# EAGLE design first_node_v2 (EAGLE 9.2.2)
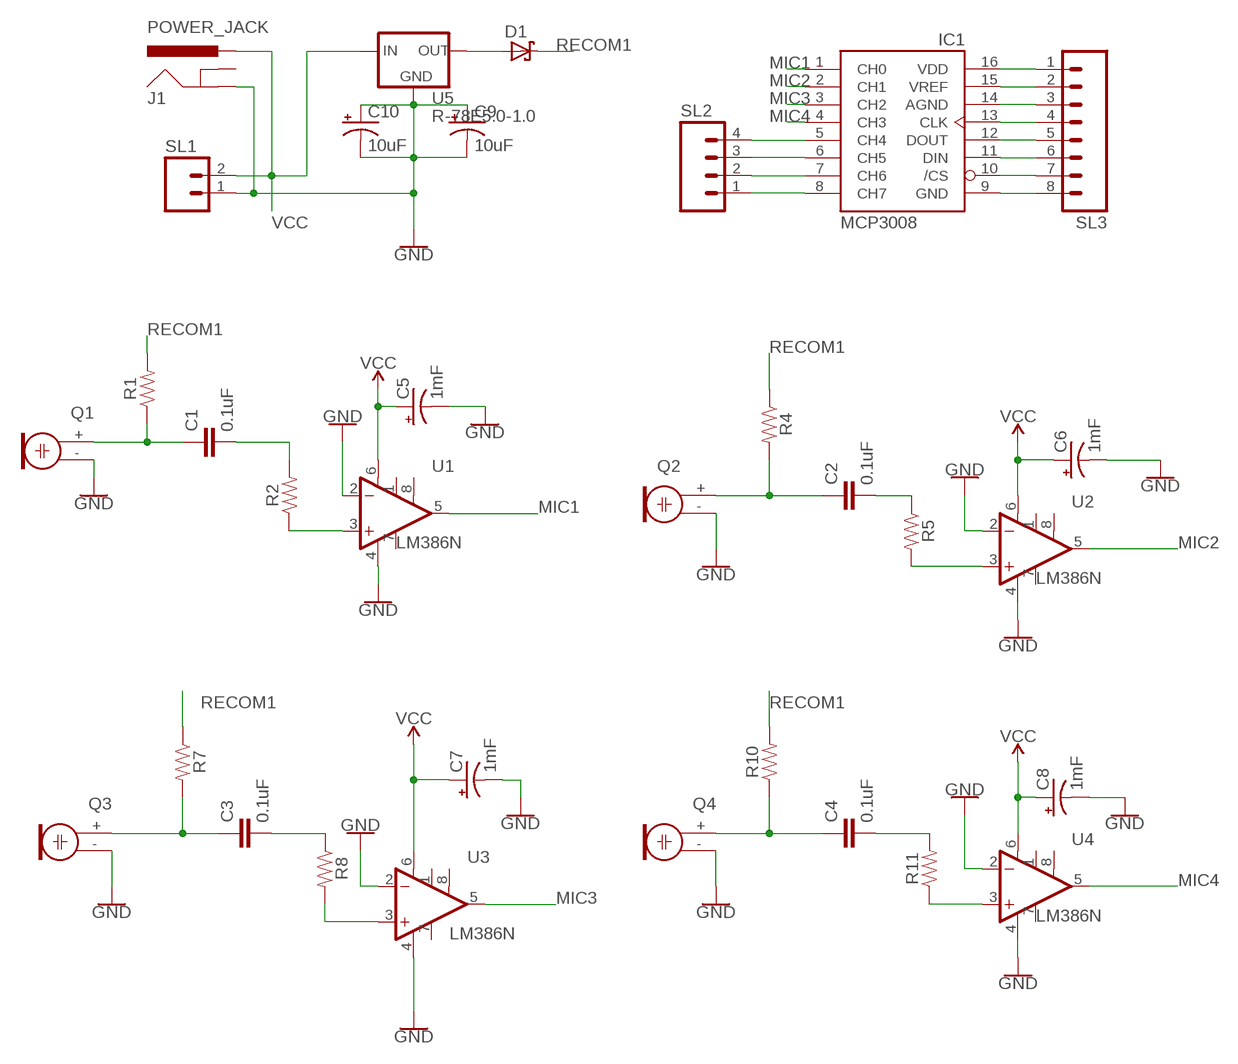
[diagram p0: schematic, sheet 1]

## Parts
C1  0.1uF  0.1UF-KIT-EZ-50V-20%  [CAP-PTH-SMALL-KIT]
C2  0.1uF  0.1UF-KIT-EZ-50V-20%  [CAP-PTH-SMALL-KIT]
C3  0.1uF  0.1UF-KIT-EZ-50V-20%  [CAP-PTH-SMALL-KIT]
C4  0.1uF  0.1UF-KIT-EZ-50V-20%  [CAP-PTH-SMALL-KIT]
C5  1mF  1000UF-RADIAL-5MM-25V-20%  [CPOL-RADIAL-5MM-10MM]
C6  1mF  1000UF-RADIAL-5MM-25V-20%  [CPOL-RADIAL-5MM-10MM]
C7  1mF  1000UF-RADIAL-5MM-25V-20%  [CPOL-RADIAL-5MM-10MM]
C8  1mF  1000UF-RADIAL-5MM-25V-20%  [CPOL-RADIAL-5MM-10MM]
C9  10uF  10UF-POLAR-RADIAL-2.5MM-25V-20%  [CPOL-RADIAL-2.5MM-5MM]
C10  10uF  10UF-POLAR-RADIAL-2.5MM-25V-20%  [CPOL-RADIAL-2.5MM-5MM]
D1  SCHOTTKY-DIODECB429-17  [CB429-17]
IC1  MCP3008  [DIL16]
J1  POWER_JACK  [POWER_JACK_PTH]
Q1  ELECTRET  [9.7ELECTRET]
Q2  ELECTRET  [9.7ELECTRET]
Q3  ELECTRET  [9.7ELECTRET]
Q4  ELECTRET  [9.7ELECTRET]
R1  RESISTORAXIAL-0.3  [AXIAL-0.3]
R2  RESISTORAXIAL-0.3  [AXIAL-0.3]
R4  RESISTORAXIAL-0.3  [AXIAL-0.3]
R5  RESISTORAXIAL-0.3  [AXIAL-0.3]
R7  RESISTORAXIAL-0.3  [AXIAL-0.3]
R8  RESISTORAXIAL-0.3  [AXIAL-0.3]
R10  RESISTORAXIAL-0.3  [AXIAL-0.3]
R11  RESISTORAXIAL-0.3  [AXIAL-0.3]
SL1  M02  [02P]
SL2  M04  [04P]
SL3  M08  [08P]
U1  LM386N  LM386  [DIP08]
U2  LM386N  LM386  [DIP08]
U3  LM386N  LM386  [DIP08]
U4  LM386N  LM386  [DIP08]
U5  R-78E5.0-1.0  [DC-DC_CONVERTER_78XX]

## Nets
GND: C5.- C6.- C7.- C8.- C9.1(+) C9.2(-) C10.1(+) C10.2(-) J1.GND Q1.- Q2.- Q3.- Q4.- SL1.1 U1.2(-IN) U1.4(V-) U2.2(-IN) U2.4(V-) U3.2(-IN) U3.4(V-) U4.2(-IN) U4.4(V-) U5.GND
MIC1: IC1.1(CH0) U1.5(OUT)
MIC2: IC1.2(CH1) U2.5(OUT)
MIC3: IC1.3(CH2) U3.5(OUT)
MIC4: IC1.4(CH3) U4.5(OUT)
N$1: C1.1 Q1.+ R1.P$1
N$2: C1.2 R2.P$2
N$3: C2.1 Q2.+ R4.P$2
N$4: C2.2 R5.P$1
N$5: C3.1 Q3.+ R7.P$2
N$6: C4.1 Q4.+ R10.P$1
N$7: C3.2 R8.P$1
N$9: C4.2 R11.P$2
N$10: IC1.5(CH4) SL2.4
N$11: R8.P$2 U3.3(+IN)
N$12: IC1.6(CH5) SL2.3
N$13: D1.A U5.VOUT(OUT)
N$14: IC1.7(CH6) SL2.2
N$15: IC1.8(CH7) SL2.1
N$16: IC1.16(VDD) SL3.1
N$17: IC1.15(VREF) SL3.2
N$18: IC1.14(AGND) SL3.3
N$19: IC1.13(CLK) SL3.4
N$20: IC1.12(DOUT) SL3.5
N$21: IC1.11(DIN) SL3.6
N$22: IC1.10(/CS) SL3.7
N$23: IC1.9(GND) SL3.8
N$24: R2.P$1 U1.3(+IN)
N$25: R11.P$1 U4.3(+IN)
N$27: R5.P$2 U2.3(+IN)
RECOM1: D1.C R1.P$2 R4.P$1 R7.P$1 R10.P$2
VCC: C5.+ C6.+ C7.+ C8.+ J1.PWR SL1.2 U1.6(V+) U2.6(V+) U3.6(V+) U4.6(V+) U5.VIN(IN)
Unconnected: J1.GNDBREAK U1.1(GAIN) U1.7(BP) U1.8(GAIN) U2.1(GAIN) U2.7(BP) U2.8(GAIN) U3.1(GAIN) U3.7(BP) U3.8(GAIN) U4.1(GAIN) U4.7(BP) U4.8(GAIN)

## Library data of the parts
C1-C4 = SparkFun-Capacitors:0.1UF: 0.1µF ceramic capacitors A capacitor is a passive two-terminal electrical component used to store electrical energy temporarily in an electric field.; PROD_ID: CAP-08370
C5-C8 = SparkFun-Capacitors:1000UF: 1,000µF/1mF ceramic capacitors A capacitor is a passive two-terminal electrical component used to store electrical energy temporarily in an electric field. CAP-08070; PROD_ID: CAP-09538
C9 C10 = SparkFun-Capacitors:10UF-POLAR: 10.0µF polarized capacitors A capacitor is a passive two-terminal electrical component used to store electrical energy temporarily in an electric field.; PROD_ID: CAP-08440
D1 = adafruit:SCHOTTKY-DIODE: Schottky Diode
IC1 = adafruit:MCP3008
J1 = SparkFun-Connectors:POWER_JACK: Power Jack Connector This is the standard 5.5mm barrel jack for power. The PTH is the most common, proven, reliable, footprint. The Slot footprint only works if the mill layer is transmitted to the PCB fab house so be warned. Here are the connectors we sell at SparkFun: DC Barrel Power Jack/Connector <https://www.sparkfun.com/products/119> (PRT-00119) DC Barrel Power Jack/Connector (SMD) <https://www.sparkfun.com/products/12748> (PRT-12748) DC Barrel Jack Adapter - Breadboard Compatible <https://www.sparkfun.com/products/10811> (PRT-10811) It is used on this SparkFun product (and many, many others): SparkFun RedBoard - Programmed with Arduino <https://www.sparkfun.com/products/12757> (DEV-12757) Also, if you need a mating power supply or connector, please check these out: Wall Adapter Power Supply - 9VDC 650mA <https://www.sparkfun.com/products/298> (TOL-00298) DC Barrel Jack Adapter - Male <https://www.sparkfun.com/products/10287> (PRT-10287); PROD_ID: CONN-08197
Q1-Q4 = adafruit:ELECTRET: Electret microphone Thru hole 2.54mm spacing with 9.7mm diameter
R1 R2 R4 R5 R7 R8 R10 R11 = SparkFun-Resistors:RESISTOR: Generic Resistor Package
SL1 = con-amp-quick:M02: AMP QUICK CONNECTOR; OC_FARNELL: unknown; OC_NEWARK: unknown
SL2 = con-amp-quick:M04: AMP QUICK CONNECTOR; OC_FARNELL: unknown; OC_NEWARK: unknown
SL3 = con-amp-quick:M08: AMP QUICK CONNECTOR; OC_FARNELL: unknown; OC_NEWARK: unknown
U1-U4 = SparkFun-IC-Amplifiers:LM386: low voltage audio power amplifier SparkFun Products FabFM Radio Kit <https://www.sparkfun.com/products/11043> (KIT-11043); PROD_ID: IC-10899
U5 = SparkFun-IC-Power:R-78E5.0-1.0: Recom Power 5V 1A DC/DC Converter The Recom R-78E5.0-X.X is a compact DC/DC converter module that is a pin for pin drop-in replacement for the LM7805 linear voltage regulator. Specifications: Input Range: 7-28V Output Voltage: 5V Output Current: 1A Max Efficiency: 91% Datasheet <https://www.recom-power.com/pdf/Innoline/R-78Exx-1.0.pdf>; PROD_ID: COM-13655

## Board
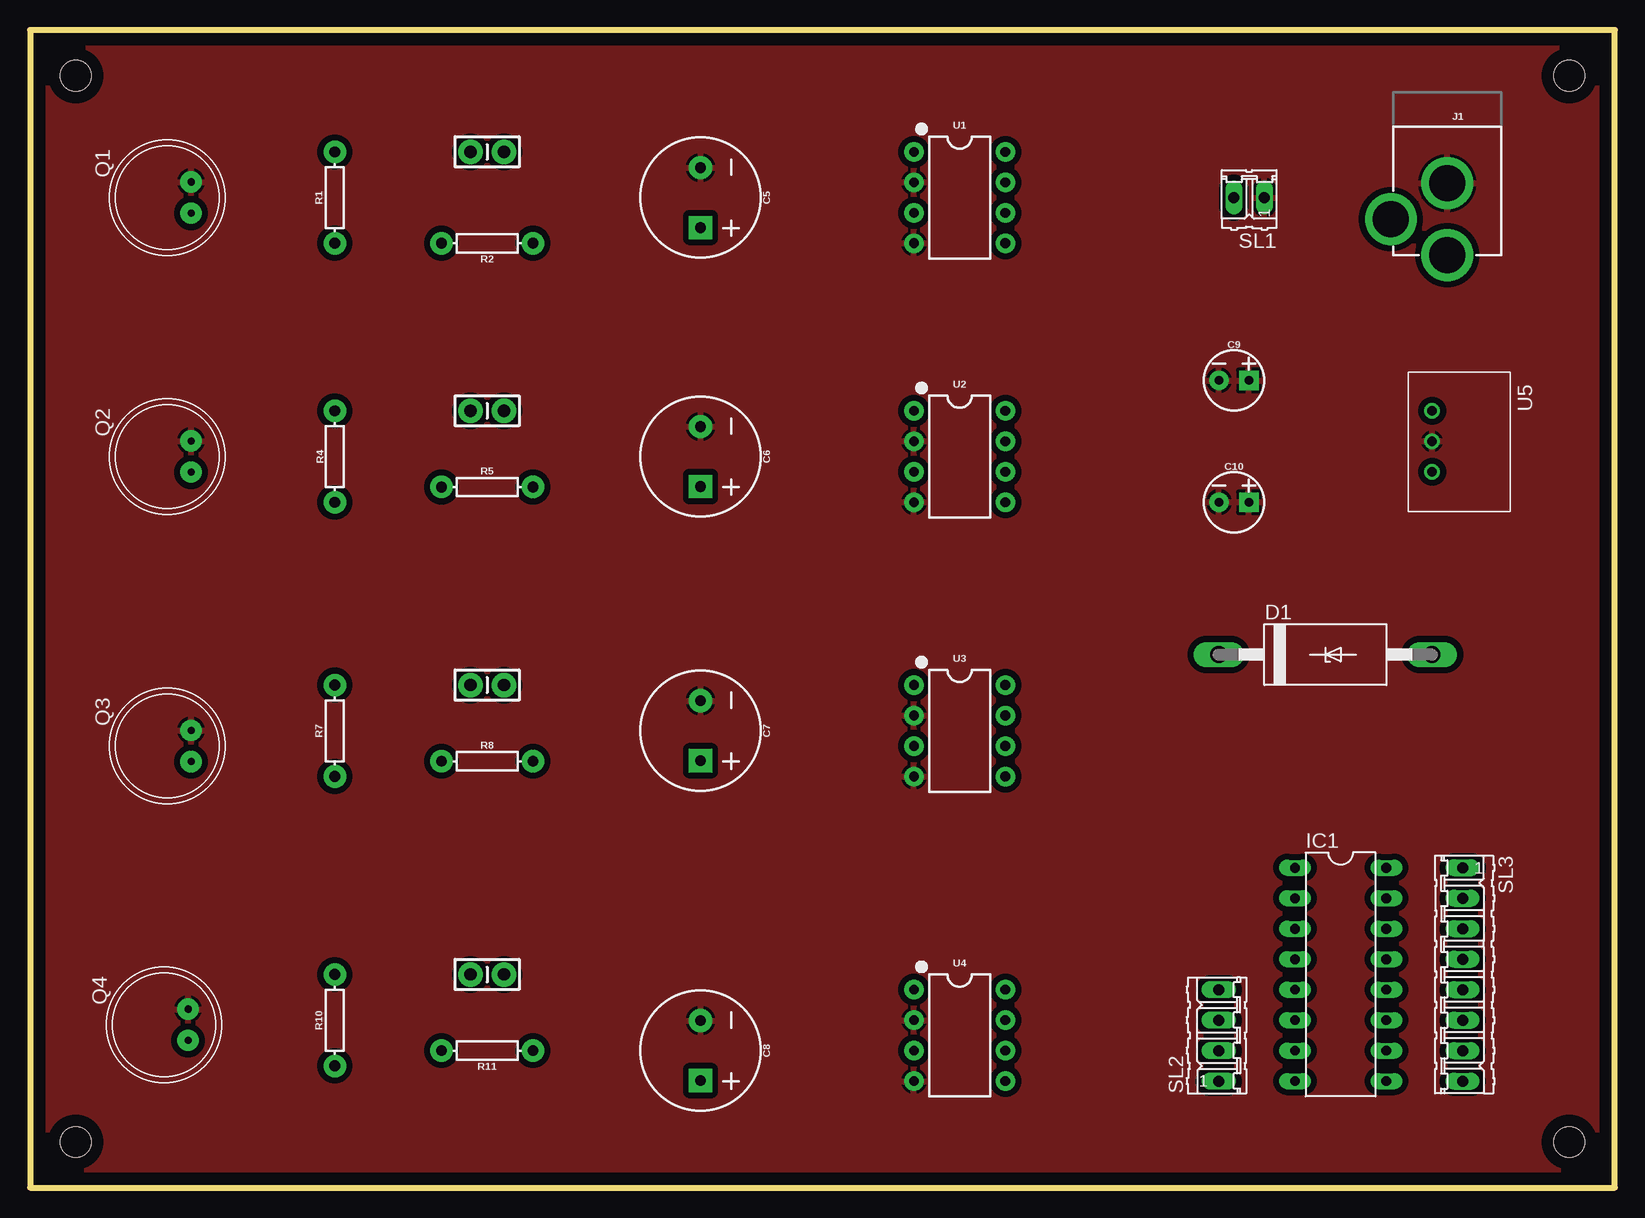
[diagram p1: board, top side]
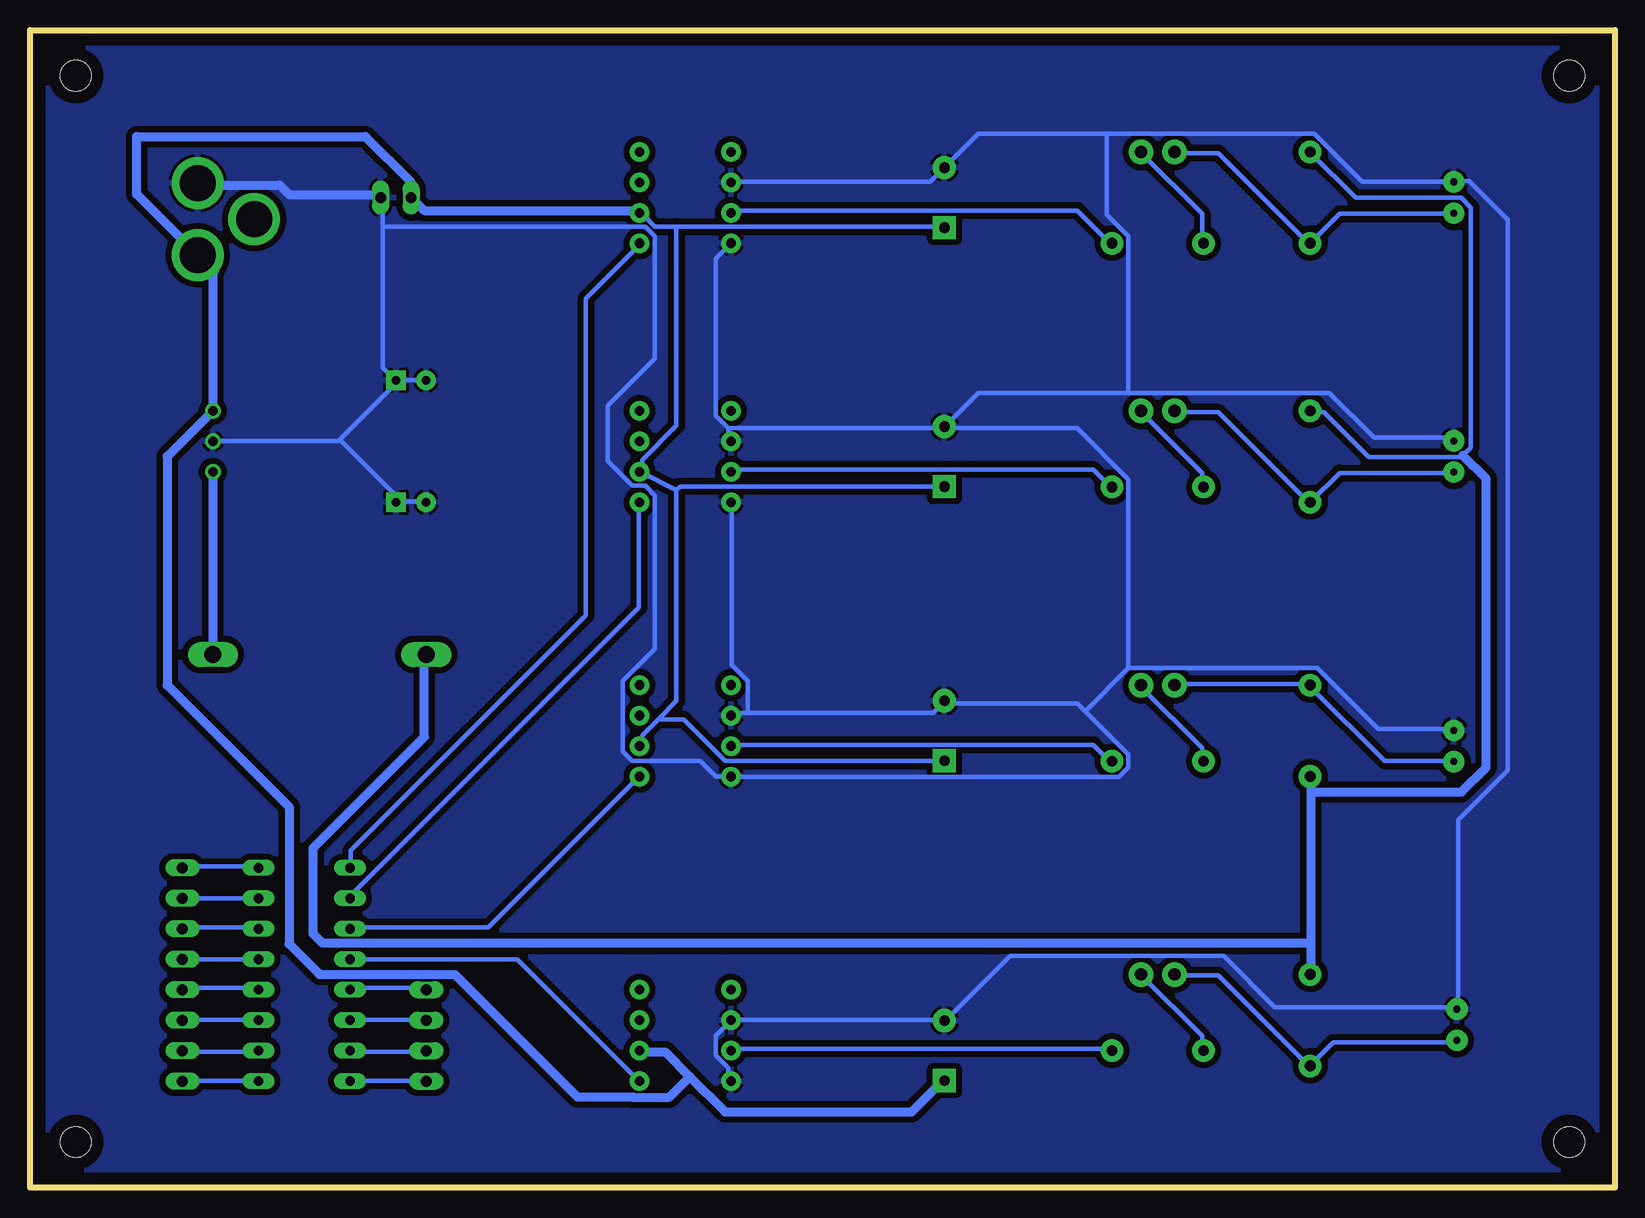
[diagram p2: board, bottom side, seen from below]

Size 132.08 x 96.52 mm. Coordinates in mm from the lower left corner, seen from the top.
Outline: 0,96.52 0,0 132.08,0 132.08,96.52 0,96.52
Copper layers (1*16): Top 0.035mm / dielectric 1.5mm / Bottom 0.035mm
Design rules "default *": minimum track width 15mil, minimum drill 0.35mm, track to track 6mil, track to pad 6mil, pad to pad 6mil, via to via 6mil, smd to smd 6mil, copper to edge 40mil, drill to drill 6mil, minimum pad ring 10mil, minimum via ring 8mil, stop-mask expansion 4mil, vias tented up to drill 0mil, thermal gap 10mil
Holes 2.54 mm at 3.81,92.71 128.27,92.71 128.27,3.81 3.81,3.81

### Footprints (pad centres in the part's own frame; a part is rotated, then mirrored left to right if it is on the bottom)
CAP-PTH-SMALL-KIT = drill 1.016 pad 2.032: 1 -1.397,0; 2 1.397,0
CPOL-RADIAL-5MM-10MM = drill 0.9 pad 1.93 square: + 2.5,0 | drill 0.9 pad 1.93: - -2.5,0
CPOL-RADIAL-2.5MM-5MM = drill 0.7 pad 1.651 square: 1 1.25,0 | drill 0.7 pad 1.651: 2 -1.25,0
CB429-17 = drill 1.397 long: A 8.89,0; C -8.89,0
DIL16 = drill 0.813 long: 1 -8.89,-3.81; 2 -6.35,-3.81; 3 -3.81,-3.81; 4 -1.27,-3.81; 5 1.27,-3.81; 6 3.81,-3.81; 7 6.35,-3.81; 8 8.89,-3.81; 9 8.89,3.81; 10 6.35,3.81; 11 3.81,3.81; 12 1.27,3.81; 13 -1.27,3.81; 14 -3.81,3.81; 15 -6.35,3.81; 16 -8.89,3.81
POWER_JACK_PTH = drill 2.997 pad 4.318: GND 0,7.7; GNDBREAK 4.7,10.7; PWR 0,13.7
9.7ELECTRET = drill 0.6 pad 1.778: + 1.3,2; - -1.3,2
AXIAL-0.3 = drill 0.9 pad 1.88: P$1 -3.81,0; P$2 3.81,0
02P = drill 0.914 long: 1 -1.27,0; 2 1.27,0
04P = drill 0.914 long: 1 -3.81,0; 2 -1.27,0; 3 1.27,0; 4 3.81,0
08P = drill 0.914 long: 1 -8.89,0; 2 -6.35,0; 3 -3.81,0; 4 -1.27,0; 5 1.27,0; 6 3.81,0; 7 6.35,0; 8 8.89,0
DIP08 = drill 0.813 pad 1.626: 1 -3.81,-3.81; 2 -1.27,-3.81; 3 1.27,-3.81; 4 3.81,-3.81; 5 3.81,3.81; 6 1.27,3.81; 7 -1.27,3.81; 8 -3.81,3.81
DC-DC_CONVERTER_78XX = drill 0.8: GND 0,0; VIN -2.54,0; VOUT 2.54,0

### Placement (x,y rotation side)
C1  38.1,86.36 0 top
C2  38.1,64.77 0 top
C3  38.1,41.91 0 top
C4  38.1,17.78 0 top
C5  55.88,82.55 270 top
C6  55.88,60.96 270 top
C7  55.88,38.1 270 top
C8  55.88,11.43 270 top
C9  100.33,67.31 0 top
C10  100.33,57.15 0 top
D1  107.95,44.45 0 top
IC1  109.22,17.78 270 top
J1  118.11,91.44 180 top
Q1  11.43,82.55 270 top
Q2  11.43,60.96 270 top
Q3  11.43,36.83 270 top
Q4  11.18,13.59 270 top
R1  25.4,82.55 90 top
R2  38.1,78.74 180 top
R4  25.4,60.96 270 top
R5  38.1,58.42 0 top
R7  25.4,38.1 90 top
R8  38.1,35.56 0 top
R10  25.4,13.97 90 top
R11  38.1,11.43 180 top
SL1  101.6,82.55 180 top
SL2  99.06,12.7 90 top
SL3  119.38,17.78 270 top
U1  77.47,82.55 270 top
U2  77.47,60.96 270 top
U3  77.47,38.1 270 top
U4  77.47,12.7 270 top
U5  116.84,62.23 270 top

### Tracks (layer width: path | path; a pad name or v marks a point on that pad's centre or on a via)
GND
  Bottom 0.381: U4.4 73.88,8.91 73.88,9.98 74.94,11.05 74.94,12.65 73.88,13.72 U4.2 73.61,13.98 56.01,13.98 C8.- 55.74,13.98 50.41,19.32 32.6,19.32 28.33,15.05 13.34,15.05 Q4.- 13.07,15.05 13.07,30.64 8.93,34.79 8.93,80.72 12.16,83.96 Q1.- 13.6,83.86 21.07,83.86 25.07,87.86 42.34,87.86 | U1.2 73.61,83.86 57.07,83.86 56.01,84.92 C5.- 55.74,85.19 53.07,87.86 42.34,87.86 | 73.88,63.32 73.88,62.26 U2.2 | 73.88,63.32 74.94,64.39 74.94,77.46 U1.4 | 40.54,66.26 53.07,66.26 55.74,63.59 C6.- | 40.54,66.26 23.8,66.26 20.07,62.52 13.6,62.52 Q2.- | 73.88,63.32 56.01,63.32 C6.- | 42.34,87.86 42.34,81.13 40.54,79.32 40.54,66.26 | 102.95,82.79 SL1.1 102.68,82.52 102.68,80.12 | 117.88,83.59 J1.GND | C10.2 99.21,57.19 101.35,57.19 C10.1 101.61,57.19 101.61,57.72 106.28,62.39 | 106.28,62.39 101.61,67.06 C9.1 | 106.28,62.39 106.41,62.26 116.81,62.26 U5.GND | C9.2 99.21,67.32 101.35,67.32 C9.1 | 102.68,80.12 102.68,68.39 101.61,67.32 C9.1 | 44.14,39.72 44.81,40.39 55.74,40.39 C7.- 56.01,40.39 56.81,39.59 72.28,39.59 | 44.14,39.72 40.54,36.12 40.54,35.05 41.34,34.25 73.61,34.25 U3.4 74.92,34.29 76.21,35.59 81.88,35.59 82.68,36.39 82.68,42.25 80.01,44.92 80.01,57.72 80.81,58.52 81.88,58.52 83.95,60.59 83.95,65.19 80.01,69.13 80.01,79.32 80.81,80.12 102.68,80.12 | 72.28,39.59 73.61,39.59 U3.2 | 72.28,39.59 72.28,42.25 73.61,43.59 73.61,56.92 U2.4 | 40.54,43.32 24.8,43.32 19.74,38.25 13.6,38.25 Q3.- | 44.14,39.72 40.54,43.32 | 40.54,43.32 40.54,59.05 44.81,63.32 55.74,63.32 C6.-
  Bottom 0.762: 102.95,82.79 110.48,82.79 111.28,83.59 117.88,83.59
  pour Bottom (isolate 0.508): 1.27,95.25 1.27,1.27 130.81,1.27 130.81,95.25
  pour Top (isolate 0.508): 1.27,95.25 1.27,1.27 130.81,1.27 130.81,95.25
MIC1
  Bottom 0.381: IC1.1 105.35,26.78 105.35,28.12 85.75,47.71 85.75,74.12 81.34,78.52 U1.5
MIC2
  Bottom 0.381: IC1.2 105.35,24.38 81.34,48.39 81.34,56.92 U2.5
MIC3
  Bottom 0.381: IC1.3 105.35,21.72 93.88,21.72 81.34,34.25 U3.5
MIC4
  Bottom 0.381: IC1.4 91.48,19.05 81.34,8.91 U4.5
N$1
  Bottom 0.381: Q1.+ 13.6,81.19 22.94,81.19 25.34,78.79 R1.P$1 25.6,78.79 33.07,86.26 36.54,86.26 C1.1
N$2
  Bottom 0.381: R2.P$2 34.4,78.79 34.4,81.19 39.47,86.26 C1.2
N$3
  Bottom 0.381: Q2.+ 13.6,59.59 22.94,59.59 25.34,57.19 R4.P$2 25.6,57.19 33.07,64.66 36.54,64.66 C2.1
N$4
  Bottom 0.381: R5.P$1 34.4,58.52 34.4,59.59 39.47,64.66 C2.2
N$5
  Bottom 0.381: Q3.+ 13.6,35.59 19.2,35.59 25.34,41.72 R7.P$2 25.6,41.99 36.54,41.99 C3.1
N$6
  Bottom 0.381: Q4.+ 13.34,12.12 23.47,12.12 25.34,10.25 R10.P$1 25.6,10.25 33.07,17.72 36.54,17.72 C4.1
N$7
  Bottom 0.381: R8.P$1 34.4,35.59 34.4,36.65 39.47,41.72 C3.2
N$9
  Bottom 0.381: R11.P$2 34.4,11.58 34.4,12.65 39.47,17.72 C4.2
N$10
  Bottom 0.381: IC1.5 105.35,16.65 99.21,16.65 SL2.4
N$11
  Bottom 0.381: U3.3 73.61,36.92 43.47,36.92 42.14,35.59 R8.P$2
N$12
  Bottom 0.381: IC1.6 105.35,13.98 99.21,13.98 SL2.3
N$13
  Bottom 0.762: U5.VOUT D1.A
N$14
  Bottom 0.381: IC1.7 105.35,11.32 99.21,11.32 SL2.2
N$15
  Bottom 0.381: IC1.8 105.35,8.91 99.21,8.91 SL2.1
N$16
  Bottom 0.381: IC1.16 113.08,26.78 119.22,26.78 SL3.1
N$17
  Bottom 0.381: IC1.15 113.08,24.12 119.22,24.12 SL3.2
N$18
  Bottom 0.381: IC1.14 113.08,21.72 119.22,21.72 SL3.3
N$19
  Bottom 0.381: SL3.4 IC1.13
N$20
  Bottom 0.381: IC1.12 113.08,16.65 119.22,16.65 SL3.5
N$21
  Bottom 0.381: IC1.11 113.08,13.98 119.22,13.98 SL3.6
N$22
  Bottom 0.381: IC1.10 113.08,11.32 119.22,11.32 SL3.7
N$23
  Bottom 0.381: IC1.9 113.08,8.91 119.22,8.91 SL3.8
N$24
  Bottom 0.381: U1.3 73.61,81.46 44.81,81.46 42.14,78.79 R2.P$1
N$25
  Bottom 0.381: U4.3 73.61,11.58 42.14,11.58 R11.P$1
N$27
  Bottom 0.381: U2.3 73.61,59.85 43.47,59.85 42.14,58.52 R5.P$2
RECOM1
  Bottom 0.381: R4.P$1 25.34,64.66 24.27,64.66 20.54,60.92 12.8,60.92 12.67,61.05 12,61.72 12,81.72 12.8,82.52 21.6,82.52 25.34,86.26 R1.P$2 | 25.34,17.98 R10.P$2 | 99.21,44.39 D1.C | 25.34,34.25 R7.P$1
  Bottom 0.762: 25.34,34.25 25.34,32.98 | 25.34,32.98 25.34,20.38 | 25.34,20.38 25.34,17.98 | 99.21,44.39 99.21,37.59 108.48,28.32 108.48,21.18 107.68,20.38 25.34,20.38 | 12.67,61.05 10.73,59.12 10.73,35.05 12.8,32.98 25.34,32.98
VCC
  Bottom 0.381: 79.61,39.19 78.21,40.59 78.21,58.15 | 79.61,39.19 81.08,37.72 81.08,36.92 U3.6 | 78.21,58.15 U2.6 81.08,59.85 81.08,60.66 78.21,63.52 78.21,80.12 | C7.+ 56.01,35.59 74.14,35.59 77.61,39.05 79.48,39.05 79.61,39.19 | 81.08,11.32 U4.6 | 56.01,8.91 C8.+ | 81.34,81.46 U1.6 81.08,81.19 80.01,80.12 78.21,80.12 | 78.21,80.12 56.01,80.12 C5.+ | C6.+ 77.9,58.46 78.21,58.15
  Bottom 0.762: J1.PWR 123.19,82.82 123.19,87.63 104.14,87.63 100.33,83.82 SL1.2 100.01,82.26 99.21,81.46 81.34,81.46 | 116.84,76.47 U5.VIN 120.65,60.96 120.65,41.91 110.49,31.75 110.49,20.32 107.95,17.78 96.67,17.78 86.47,7.58 81.88,7.58 81.84,7.54 78.82,7.54 77.09,9.27 | 81.08,11.32 79.15,11.32 77.09,9.27 | 56.01,8.91 58.61,6.31 74.14,6.31 77.09,9.27
  Bottom 1.016: J1.PWR 116.84,76.47